# EAGLE schematic K019 with eeprom (EAGLE 6.3), part 1 of 2

## Sheet 1 of 4
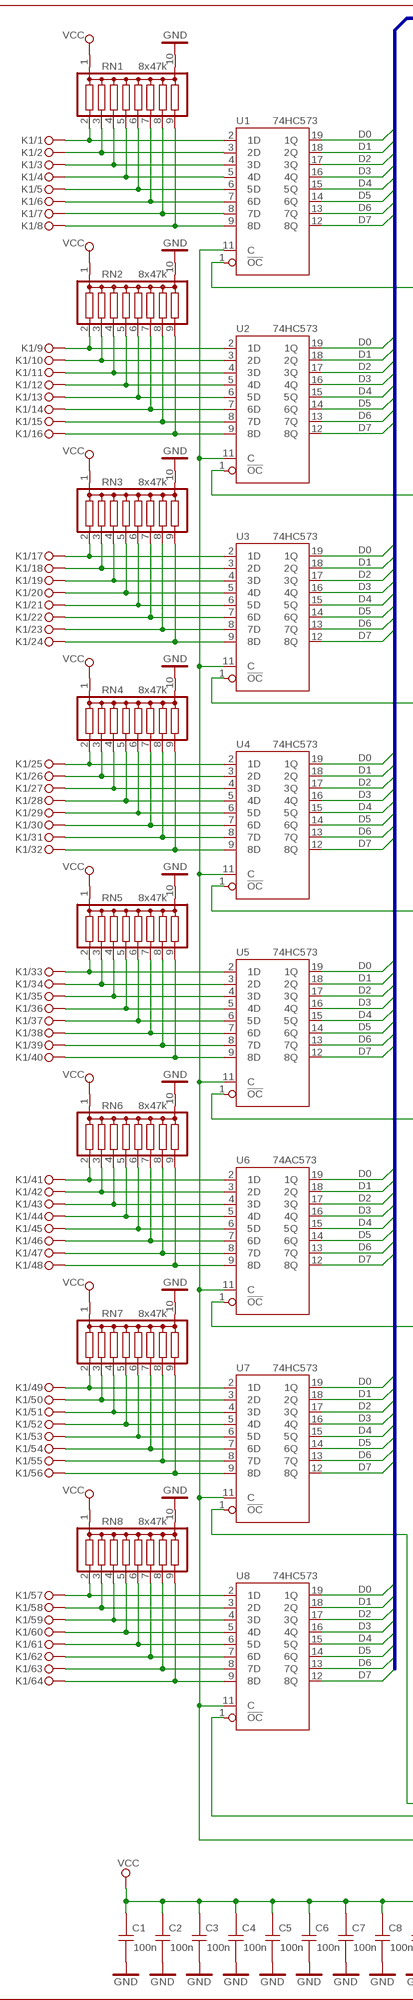
[diagram p0: schematic, sheet 1, part 1 of 2]
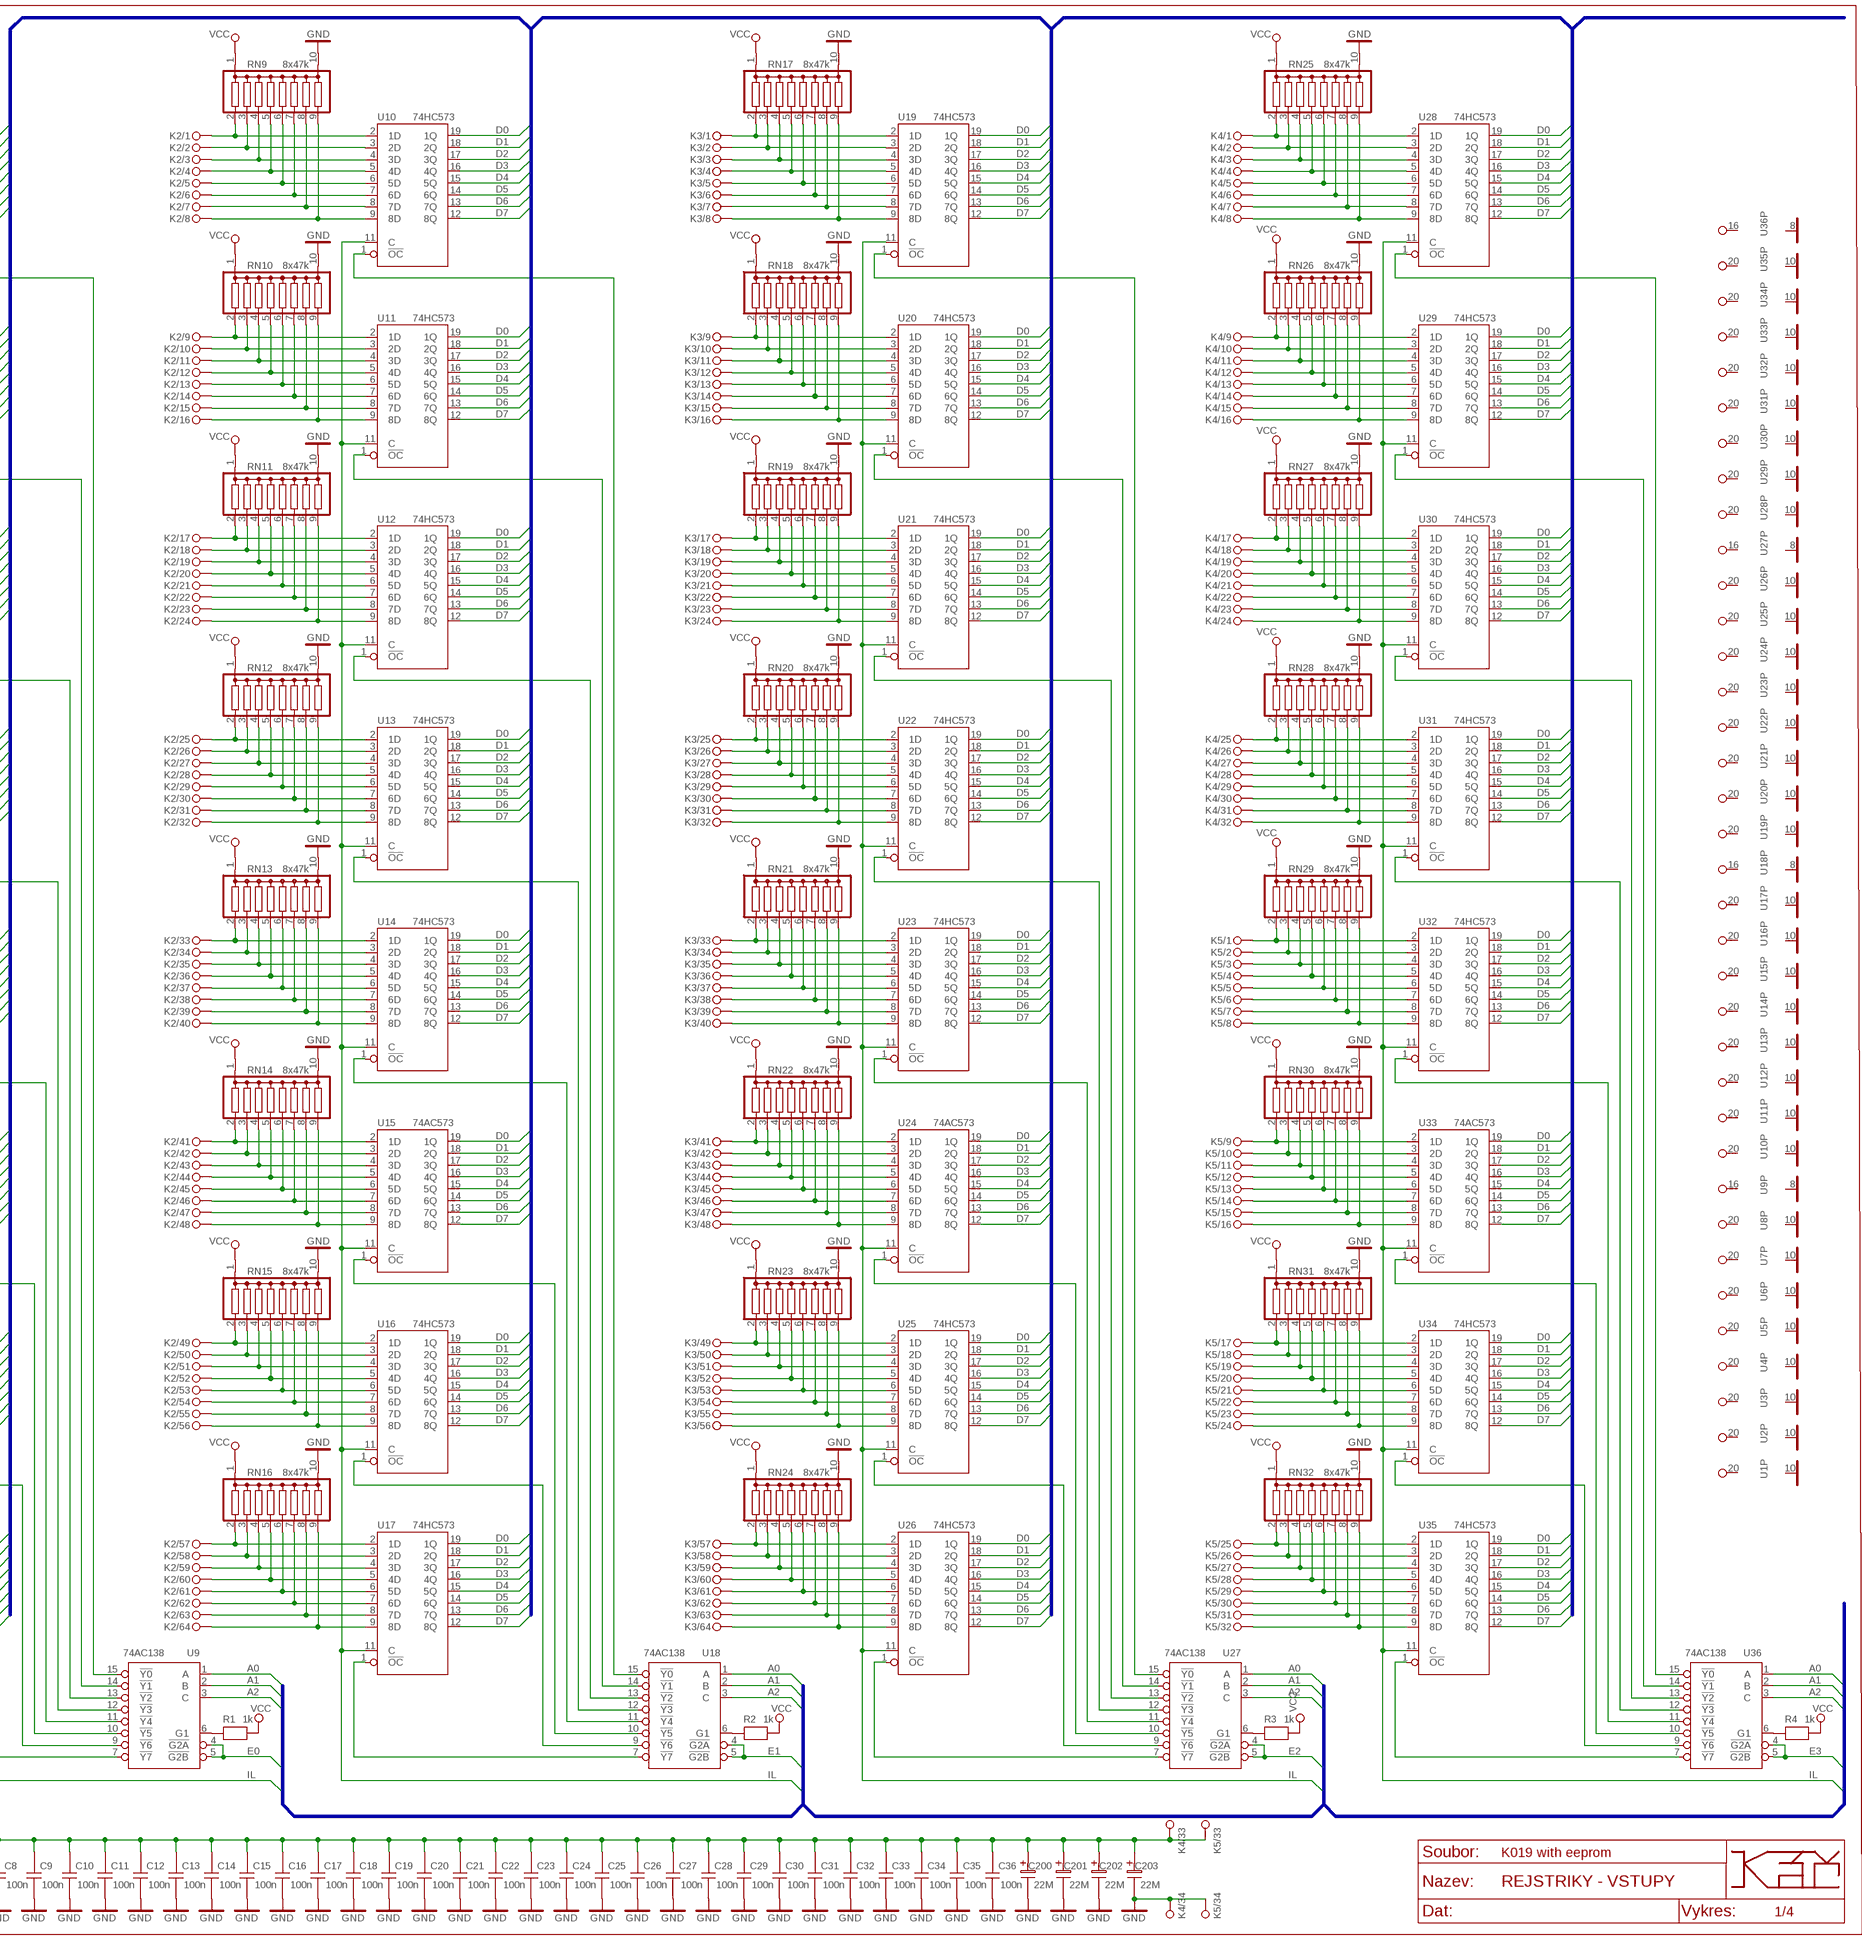
[diagram p1: schematic, sheet 1, part 2 of 2]

### Parts
C1  100n  C-5X8@2  [C-5-2X8]
C2  100n  C-5X8@2  [C-5-2X8]
C3  100n  C-5X8@2  [C-5-2X8]
C4  100n  C-5X8@2  [C-5-2X8]
C5  100n  C-5X8@2  [C-5-2X8]
C6  100n  C-5X8@2  [C-5-2X8]
C7  100n  C-5X8@2  [C-5-2X8]
C8  100n  C-5X8@2  [C-5-2X8]
C9  100n  C-5X8@2  [C-5-2X8]
C10  100n  C-5X8@2  [C-5-2X8]
C11  100n  C-5X8@2  [C-5-2X8]
C12  100n  C-5X8@2  [C-5-2X8]
C13  100n  C-5X8@2  [C-5-2X8]
C14  100n  C-5X8@2  [C-5-2X8]
C15  100n  C-5X8@2  [C-5-2X8]
C16  100n  C-5X8@2  [C-5-2X8]
C17  100n  C-5X8@2  [C-5-2X8]
C18  100n  C-5X8@2  [C-5-2X8]
C19  100n  C-5X8@2  [C-5-2X8]
C20  100n  C-5X8@2  [C-5-2X8]
C21  100n  C-5X8@2  [C-5-2X8]
C22  100n  C-5X8@2  [C-5-2X8]
C23  100n  C-5X8@2  [C-5-2X8]
C24  100n  C-5X8@2  [C-5-2X8]
C25  100n  C-5X8@2  [C-5-2X8]
C26  100n  C-5X8@2  [C-5-2X8]
C27  100n  C-5X8@2  [C-5-2X8]
C28  100n  C-5X8@2  [C-5-2X8]
C29  100n  C-5X8@2  [C-5-2X8]
C30  100n  C-5X8@2  [C-5-2X8]
C31  100n  C-5X8@2  [C-5-2X8]
C32  100n  C-5X8@2  [C-5-2X8]
C33  100n  C-5X8@2  [C-5-2X8]
C34  100n  C-5X8@2  [C-5-2X8]
C35  100n  C-5X8@2  [C-5-2X8]
C36  100n  C-5X8@2  [C-5-2X8]
C200  22M  EC-2/5  [EC-2/5]
C201  22M  EC-2/5  [EC-2/5]
C202  22M  EC-2/5  [EC-2/5]
C203  22M  EC-2/5  [EC-2/5]
K1  KON64  [KON64]
K2  KON64  [KON64]
K3  KON64  [KON64]
K4  KON34  [KON34]
K5  KON34  [KON34]
R1  1k  R-10-0,8@2  [R-7,5]
R2  1k  R-10-0,8@2  [R-7,5]
R3  1k  R-10-0,8@2  [R-7,5]
R4  1k  R-10-0,8@2  [R-7,5]
RN1  8x47k  R8+@3  [G08R+@3]
RN2  8x47k  R8+@3  [G08R+@3]
RN3  8x47k  R8+@3  [G08R+@3]
RN4  8x47k  R8+@4  [G08R+@4]
RN5  8x47k  R8+@4  [G08R+@4]
RN6  8x47k  R8+@4  [G08R+@4]
RN7  8x47k  R8+@4  [G08R+@4]
RN8  8x47k  R8+@4  [G08R+@4]
RN9  8x47k  R8+@3  [G08R+@3]
RN10  8x47k  R8+@3  [G08R+@3]
RN11  8x47k  R8+@3  [G08R+@3]
RN12  8x47k  R8+@3  [G08R+@3]
RN13  8x47k  R8+@3  [G08R+@3]
RN14  8x47k  R8+@3  [G08R+@3]
RN15  8x47k  R8+@3  [G08R+@3]
RN16  8x47k  R8+@3  [G08R+@3]
RN17  8x47k  R8+@3  [G08R+@3]
RN18  8x47k  R8+@3  [G08R+@3]
RN19  8x47k  R8+@3  [G08R+@3]
RN20  8x47k  R8+@3  [G08R+@3]
RN21  8x47k  R8+@3  [G08R+@3]
RN22  8x47k  R8+@3  [G08R+@3]
RN23  8x47k  R8+@3  [G08R+@3]
RN24  8x47k  R8+@3  [G08R+@3]
RN25  8x47k  R8+@3  [G08R+@3]
RN26  8x47k  R8+@3  [G08R+@3]
RN27  8x47k  R8+@3  [G08R+@3]
RN28  8x47k  R8+@3  [G08R+@3]
RN29  8x47k  R8+@3  [G08R+@3]
RN30  8x47k  R8+@3  [G08R+@3]
RN31  8x47k  R8+@3  [G08R+@3]
RN32  8x47k  R8+@3  [G08R+@3]
U1  74HC573  74AC573@2  [DIL20]
U2  74HC573  74AC573@2  [DIL20]
U3  74HC573  74AC573@2  [DIL20]
U4  74HC573  74AC573@2  [DIL20]
U5  74HC573  74AC573@2  [DIL20]
U6  74AC573  74AC573@2  [DIL20]
U7  74HC573  74AC573@2  [DIL20]
U8  74HC573  74AC573@2  [DIL20]
U9  74AC138  [DIL16]
U10  74HC573  74AC573@2  [DIL20]
U11  74HC573  74AC573@2  [DIL20]
U12  74HC573  74AC573@2  [DIL20]
U13  74HC573  74AC573@2  [DIL20]
U14  74HC573  74AC573@2  [DIL20]
U15  74AC573  74AC573@2  [DIL20]
U16  74HC573  74AC573@2  [DIL20]
U17  74HC573  74AC573@2  [DIL20]
U18  74AC138  [DIL16]
U19  74HC573  74AC573@2  [DIL20]
U20  74HC573  74AC573@2  [DIL20]
U21  74HC573  74AC573@2  [DIL20]
U22  74HC573  74AC573@2  [DIL20]
U23  74HC573  74AC573@2  [DIL20]
U24  74AC573  74AC573@2  [DIL20]
U25  74HC573  74AC573@2  [DIL20]
U26  74HC573  74AC573@2  [DIL20]
U27  74AC138  [DIL16]
U28  74HC573  74AC573@2  [DIL20]
U29  74HC573  74AC573@2  [DIL20]
U30  74HC573  74AC573@2  [DIL20]
U31  74HC573  74AC573@2  [DIL20]
U32  74HC573  74AC573@2  [DIL20]
U33  74AC573  74AC573@2  [DIL20]
U34  74HC573  74AC573@2  [DIL20]
U35  74HC573  74AC573@2  [DIL20]
U36  74AC138  [DIL16]

### Nets
A0: U9.1(A) U18.1(A) U27.1(A) U36.1(A) ; also sheet 2,3,4
A1: U9.2(B) U18.2(B) U27.2(B) U36.2(B) ; also sheet 2,3,4
A2: U9.3(C) U18.3(C) U27.3(C) U36.3(C) ; also sheet 2,3,4
D0: U1.19(1Q) U2.19(1Q) U3.19(1Q) U4.19(1Q) U5.19(1Q) U6.19(1Q) U7.19(1Q) U8.19(1Q) U10.19(1Q) U11.19(1Q) U12.19(1Q) U13.19(1Q) U14.19(1Q) U15.19(1Q) U16.19(1Q) U17.19(1Q) U19.19(1Q) U20.19(1Q) U21.19(1Q) U22.19(1Q) U23.19(1Q) U24.19(1Q) U25.19(1Q) U26.19(1Q) U28.19(1Q) U29.19(1Q) U30.19(1Q) U31.19(1Q) U32.19(1Q) U33.19(1Q) U34.19(1Q) U35.19(1Q) ; also sheet 2,3,4
D1: U1.18(2Q) U2.18(2Q) U3.18(2Q) U4.18(2Q) U5.18(2Q) U6.18(2Q) U7.18(2Q) U8.18(2Q) U10.18(2Q) U11.18(2Q) U12.18(2Q) U13.18(2Q) U14.18(2Q) U15.18(2Q) U16.18(2Q) U17.18(2Q) U19.18(2Q) U20.18(2Q) U21.18(2Q) U22.18(2Q) U23.18(2Q) U24.18(2Q) U25.18(2Q) U26.18(2Q) U28.18(2Q) U29.18(2Q) U30.18(2Q) U31.18(2Q) U32.18(2Q) U33.18(2Q) U34.18(2Q) U35.18(2Q) ; also sheet 2,3,4
D2: U1.17(3Q) U2.17(3Q) U3.17(3Q) U4.17(3Q) U5.17(3Q) U6.17(3Q) U7.17(3Q) U8.17(3Q) U10.17(3Q) U11.17(3Q) U12.17(3Q) U13.17(3Q) U14.17(3Q) U15.17(3Q) U16.17(3Q) U17.17(3Q) U19.17(3Q) U20.17(3Q) U21.17(3Q) U22.17(3Q) U23.17(3Q) U24.17(3Q) U25.17(3Q) U26.17(3Q) U28.17(3Q) U29.17(3Q) U30.17(3Q) U31.17(3Q) U32.17(3Q) U33.17(3Q) U34.17(3Q) U35.17(3Q) ; also sheet 2,3,4
D3: U1.16(4Q) U2.16(4Q) U3.16(4Q) U4.16(4Q) U5.16(4Q) U6.16(4Q) U7.16(4Q) U8.16(4Q) U10.16(4Q) U11.16(4Q) U12.16(4Q) U13.16(4Q) U14.16(4Q) U15.16(4Q) U16.16(4Q) U17.16(4Q) U19.16(4Q) U20.16(4Q) U21.16(4Q) U22.16(4Q) U23.16(4Q) U24.16(4Q) U25.16(4Q) U26.16(4Q) U28.16(4Q) U29.16(4Q) U30.16(4Q) U31.16(4Q) U32.16(4Q) U33.16(4Q) U34.16(4Q) U35.16(4Q) ; also sheet 2,3,4
D4: U1.15(5Q) U2.15(5Q) U3.15(5Q) U4.15(5Q) U5.15(5Q) U6.15(5Q) U7.15(5Q) U8.15(5Q) U10.15(5Q) U11.15(5Q) U12.15(5Q) U13.15(5Q) U14.15(5Q) U15.15(5Q) U16.15(5Q) U17.15(5Q) U19.15(5Q) U20.15(5Q) U21.15(5Q) U22.15(5Q) U23.15(5Q) U24.15(5Q) U25.15(5Q) U26.15(5Q) U28.15(5Q) U29.15(5Q) U30.15(5Q) U31.15(5Q) U32.15(5Q) U33.15(5Q) U34.15(5Q) U35.15(5Q) ; also sheet 2,3,4
D5: U1.14(6Q) U2.14(6Q) U3.14(6Q) U4.14(6Q) U5.14(6Q) U6.14(6Q) U7.14(6Q) U8.14(6Q) U10.14(6Q) U11.14(6Q) U12.14(6Q) U13.14(6Q) U14.14(6Q) U15.14(6Q) U16.14(6Q) U17.14(6Q) U19.14(6Q) U20.14(6Q) U21.14(6Q) U22.14(6Q) U23.14(6Q) U24.14(6Q) U25.14(6Q) U26.14(6Q) U28.14(6Q) U29.14(6Q) U30.14(6Q) U31.14(6Q) U32.14(6Q) U33.14(6Q) U34.14(6Q) U35.14(6Q) ; also sheet 2,3,4
D6: U1.13(7Q) U2.13(7Q) U3.13(7Q) U4.13(7Q) U5.13(7Q) U6.13(7Q) U7.13(7Q) U8.13(7Q) U10.13(7Q) U11.13(7Q) U12.13(7Q) U13.13(7Q) U14.13(7Q) U15.13(7Q) U16.13(7Q) U17.13(7Q) U19.13(7Q) U20.13(7Q) U21.13(7Q) U22.13(7Q) U23.13(7Q) U24.13(7Q) U25.13(7Q) U26.13(7Q) U28.13(7Q) U29.13(7Q) U30.13(7Q) U31.13(7Q) U32.13(7Q) U33.13(7Q) U34.13(7Q) U35.13(7Q) ; also sheet 2,3,4
D7: U1.12(8Q) U2.12(8Q) U3.12(8Q) U4.12(8Q) U5.12(8Q) U6.12(8Q) U7.12(8Q) U8.12(8Q) U10.12(8Q) U11.12(8Q) U12.12(8Q) U13.12(8Q) U14.12(8Q) U15.12(8Q) U16.12(8Q) U17.12(8Q) U19.12(8Q) U20.12(8Q) U21.12(8Q) U22.12(8Q) U23.12(8Q) U24.12(8Q) U25.12(8Q) U26.12(8Q) U28.12(8Q) U29.12(8Q) U30.12(8Q) U31.12(8Q) U32.12(8Q) U33.12(8Q) U34.12(8Q) U35.12(8Q) ; also sheet 2,3,4
E0: U9.4(!G2A) U9.5(!G2B) ; also sheet 4
E1: U18.4(!G2A) U18.5(!G2B) ; also sheet 4
E2: U27.4(!G2A) U27.5(!G2B) ; also sheet 4
E3: U36.4(!G2A) U36.5(!G2B) ; also sheet 4
GND: C1.1 C2.1 C3.1 C4.1 C5.1 C6.1 C7.1 C8.1 C9.1 C10.1 C11.1 C12.1 C13.1 C14.1 C15.1 C16.1 C17.1 C18.1 C19.1 C20.1 C21.1 C22.1 C23.1 C24.1 C25.1 C26.1 C27.1 C28.1 C29.1 C30.1 C31.1 C32.1 C33.1 C34.1 C35.1 C36.1 C200.1 C201.1 C202.1 C203.1 K4.34 K5.34 RN1.10 RN2.10 RN3.10 RN4.10 RN5.10 RN6.10 RN7.10 RN8.10 RN9.10 RN10.10 RN11.10 RN12.10 RN13.10 RN14.10 RN15.10 RN16.10 RN17.10 RN18.10 RN19.10 RN20.10 RN21.10 RN22.10 RN23.10 RN24.10 RN25.10 RN26.10 RN27.10 RN28.10 RN29.10 RN30.10 RN31.10 RN32.10 ; also sheet 2,3,4
IL: U1.11(C) U2.11(C) U3.11(C) U4.11(C) U5.11(C) U6.11(C) U7.11(C) U8.11(C) U10.11(C) U11.11(C) U12.11(C) U13.11(C) U14.11(C) U15.11(C) U16.11(C) U17.11(C) U19.11(C) U20.11(C) U21.11(C) U22.11(C) U23.11(C) U24.11(C) U25.11(C) U26.11(C) U28.11(C) U29.11(C) U30.11(C) U31.11(C) U32.11(C) U33.11(C) U34.11(C) U35.11(C) ; also sheet 4
N$1: U8.1(!OC) U9.7(!Y7)
N$2: U7.1(!OC) U9.9(!Y6)
N$3: U6.1(!OC) U9.10(!Y5)
N$4: U5.1(!OC) U9.11(!Y4)
N$5: U4.1(!OC) U9.12(!Y3)
N$6: U3.1(!OC) U9.13(!Y2)
N$7: U2.1(!OC) U9.14(!Y1)
N$8: U1.1(!OC) U9.15(!Y0)
N$9: U26.1(!OC) U27.7(!Y7)
N$10: K1.1 RN1.2 U1.2(1D)
N$11: K1.2 RN1.3 U1.3(2D)
N$12: K1.3 RN1.4 U1.4(3D)
N$13: K1.4 RN1.5 U1.5(4D)
N$14: K1.5 RN1.6 U1.6(5D)
N$15: K1.6 RN1.7 U1.7(6D)
N$16: K1.7 RN1.8 U1.8(7D)
N$17: K1.8 RN1.9 U1.9(8D)
N$18: K1.9 RN2.2 U2.2(1D)
N$19: K1.10 RN2.3 U2.3(2D)
N$20: K1.11 RN2.4 U2.4(3D)
N$21: K1.12 RN2.5 U2.5(4D)
N$22: K1.13 RN2.6 U2.6(5D)
N$23: K1.14 RN2.7 U2.7(6D)
N$24: K1.15 RN2.8 U2.8(7D)
N$25: K1.16 RN2.9 U2.9(8D)
N$26: K1.17 RN3.2 U3.2(1D)
N$27: K1.18 RN3.3 U3.3(2D)
N$28: K1.19 RN3.4 U3.4(3D)
N$29: K1.20 RN3.5 U3.5(4D)
N$30: K1.21 RN3.6 U3.6(5D)
N$31: K1.22 RN3.7 U3.7(6D)
N$32: K1.23 RN3.8 U3.8(7D)
N$33: K1.24 RN3.9 U3.9(8D)
N$34: K1.25 RN4.2 U4.2(1D)
N$35: K1.26 RN4.3 U4.3(2D)
N$36: K1.27 RN4.4 U4.4(3D)
N$37: K1.28 RN4.5 U4.5(4D)
N$38: K1.29 RN4.6 U4.6(5D)
N$39: K1.30 RN4.7 U4.7(6D)
N$40: K1.31 RN4.8 U4.8(7D)
N$41: K1.32 RN4.9 U4.9(8D)
N$42: K1.33 RN5.2 U5.2(1D)
N$43: K1.34 RN5.3 U5.3(2D)
N$44: K1.35 RN5.4 U5.4(3D)
N$45: K1.36 RN5.5 U5.5(4D)
N$46: K1.37 RN5.6 U5.6(5D)
N$47: K1.38 RN5.7 U5.7(6D)
N$48: K1.39 RN5.8 U5.8(7D)
N$49: K1.40 RN5.9 U5.9(8D)
N$50: K1.41 RN6.2 U6.2(1D)
N$51: K1.42 RN6.3 U6.3(2D)
N$52: K1.43 RN6.4 U6.4(3D)
N$53: K1.44 RN6.5 U6.5(4D)
N$54: K1.45 RN6.6 U6.6(5D)
N$55: K1.46 RN6.7 U6.7(6D)
N$56: K1.47 RN6.8 U6.8(7D)
N$57: K1.48 RN6.9 U6.9(8D)
N$58: K1.49 RN7.2 U7.2(1D)
N$59: K1.50 RN7.3 U7.3(2D)
N$60: K1.51 RN7.4 U7.4(3D)
N$61: K1.52 RN7.5 U7.5(4D)
N$62: K1.53 RN7.6 U7.6(5D)
N$63: K1.54 RN7.7 U7.7(6D)
N$64: K1.55 RN7.8 U7.8(7D)
N$65: K1.56 RN7.9 U7.9(8D)
N$66: K1.57 RN8.2 U8.2(1D)
N$67: K1.58 RN8.3 U8.3(2D)
N$68: K1.59 RN8.4 U8.4(3D)
N$69: K1.60 RN8.5 U8.5(4D)
N$70: K1.61 RN8.6 U8.6(5D)
N$71: K1.62 RN8.7 U8.7(6D)
N$72: K1.63 RN8.8 U8.8(7D)
N$73: K1.64 RN8.9 U8.9(8D)
N$74: U17.1(!OC) U18.7(!Y7)
N$75: U16.1(!OC) U18.9(!Y6)
N$76: U15.1(!OC) U18.10(!Y5)
N$77: U14.1(!OC) U18.11(!Y4)
N$78: U13.1(!OC) U18.12(!Y3)
N$79: U12.1(!OC) U18.13(!Y2)
N$80: U11.1(!OC) U18.14(!Y1)
N$81: U10.1(!OC) U18.15(!Y0)
N$82: U25.1(!OC) U27.9(!Y6)
N$83: K2.1 RN9.2 U10.2(1D)
N$84: K2.2 RN9.3 U10.3(2D)
N$85: K2.3 RN9.4 U10.4(3D)
N$86: K2.4 RN9.5 U10.5(4D)
N$87: K2.5 RN9.6 U10.6(5D)
N$88: K2.6 RN9.7 U10.7(6D)
N$89: K2.7 RN9.8 U10.8(7D)
N$90: K2.8 RN9.9 U10.9(8D)
N$91: K2.9 RN10.2 U11.2(1D)
N$92: K2.10 RN10.3 U11.3(2D)
N$93: K2.11 RN10.4 U11.4(3D)
N$94: K2.12 RN10.5 U11.5(4D)
N$95: K2.13 RN10.6 U11.6(5D)
N$96: K2.14 RN10.7 U11.7(6D)
N$97: K2.15 RN10.8 U11.8(7D)
N$98: K2.16 RN10.9 U11.9(8D)
N$99: K2.17 RN11.2 U12.2(1D)
N$100: K2.18 RN11.3 U12.3(2D)
N$101: K2.19 RN11.4 U12.4(3D)
N$102: K2.20 RN11.5 U12.5(4D)
N$103: K2.21 RN11.6 U12.6(5D)
N$104: K2.22 RN11.7 U12.7(6D)
N$105: K2.23 RN11.8 U12.8(7D)
N$106: K2.24 RN11.9 U12.9(8D)
N$107: K2.25 RN12.2 U13.2(1D)
N$108: K2.26 RN12.3 U13.3(2D)
N$109: K2.27 RN12.4 U13.4(3D)
N$110: K2.28 RN12.5 U13.5(4D)
N$111: K2.29 RN12.6 U13.6(5D)
N$112: K2.30 RN12.7 U13.7(6D)
N$113: K2.31 RN12.8 U13.8(7D)
N$114: K2.32 RN12.9 U13.9(8D)
N$115: K2.33 RN13.2 U14.2(1D)
N$116: K2.34 RN13.3 U14.3(2D)
N$117: K2.35 RN13.4 U14.4(3D)
N$118: K2.36 RN13.5 U14.5(4D)
N$119: K2.37 RN13.6 U14.6(5D)
N$120: K2.38 RN13.7 U14.7(6D)
N$121: K2.39 RN13.8 U14.8(7D)
N$122: K2.40 RN13.9 U14.9(8D)
N$123: K2.41 RN14.2 U15.2(1D)
N$124: K2.42 RN14.3 U15.3(2D)
N$125: K2.43 RN14.4 U15.4(3D)
N$126: K2.44 RN14.5 U15.5(4D)
N$127: K2.45 RN14.6 U15.6(5D)
N$128: K2.46 RN14.7 U15.7(6D)
N$129: K2.47 RN14.8 U15.8(7D)
N$130: K2.48 RN14.9 U15.9(8D)
N$131: K2.49 RN15.2 U16.2(1D)
N$132: K2.50 RN15.3 U16.3(2D)
N$133: K2.51 RN15.4 U16.4(3D)
N$134: K2.52 RN15.5 U16.5(4D)
N$135: K2.53 RN15.6 U16.6(5D)
N$136: K2.54 RN15.7 U16.7(6D)
N$137: K2.55 RN15.8 U16.8(7D)
N$138: K2.56 RN15.9 U16.9(8D)
N$139: K2.57 RN16.2 U17.2(1D)
N$140: K2.58 RN16.3 U17.3(2D)
N$141: K2.59 RN16.4 U17.4(3D)
N$142: K2.60 RN16.5 U17.5(4D)
N$143: K2.61 RN16.6 U17.6(5D)
N$144: K2.62 RN16.7 U17.7(6D)
N$145: K2.63 RN16.8 U17.8(7D)
N$146: K2.64 RN16.9 U17.9(8D)
N$147: U24.1(!OC) U27.10(!Y5)
N$148: U23.1(!OC) U27.11(!Y4)
N$149: U22.1(!OC) U27.12(!Y3)
N$150: U21.1(!OC) U27.13(!Y2)
N$151: U20.1(!OC) U27.14(!Y1)
N$152: U19.1(!OC) U27.15(!Y0)
N$153: K3.1 RN17.2 U19.2(1D)
N$154: K3.2 RN17.3 U19.3(2D)
N$155: K3.3 RN17.4 U19.4(3D)
N$156: K3.4 RN17.5 U19.5(4D)
N$157: K3.5 RN17.6 U19.6(5D)
N$158: K3.6 RN17.7 U19.7(6D)
N$159: K3.7 RN17.8 U19.8(7D)
N$160: K3.8 RN17.9 U19.9(8D)
N$161: K3.9 RN18.2 U20.2(1D)
N$162: K3.10 RN18.3 U20.3(2D)
N$163: K3.11 RN18.4 U20.4(3D)
N$164: K3.12 RN18.5 U20.5(4D)
N$165: K3.13 RN18.6 U20.6(5D)
N$166: K3.14 RN18.7 U20.7(6D)
N$167: K3.15 RN18.8 U20.8(7D)
N$168: K3.16 RN18.9 U20.9(8D)
N$169: K3.17 RN19.2 U21.2(1D)
N$170: K3.18 RN19.3 U21.3(2D)
N$171: K3.19 RN19.4 U21.4(3D)
N$172: K3.20 RN19.5 U21.5(4D)
N$173: K3.21 RN19.6 U21.6(5D)
N$174: K3.22 RN19.7 U21.7(6D)
N$175: K3.23 RN19.8 U21.8(7D)
N$176: K3.24 RN19.9 U21.9(8D)
N$177: K3.25 RN20.2 U22.2(1D)
N$178: K3.26 RN20.3 U22.3(2D)
N$179: K3.27 RN20.4 U22.4(3D)
N$180: K3.28 RN20.5 U22.5(4D)
N$181: K3.29 RN20.6 U22.6(5D)
N$182: K3.30 RN20.7 U22.7(6D)
N$183: K3.31 RN20.8 U22.8(7D)
N$184: K3.32 RN20.9 U22.9(8D)
N$185: K3.33 RN21.2 U23.2(1D)
N$186: K3.34 RN21.3 U23.3(2D)
N$187: K3.35 RN21.4 U23.4(3D)
N$188: K3.36 RN21.5 U23.5(4D)
N$189: K3.37 RN21.6 U23.6(5D)
N$190: K3.38 RN21.7 U23.7(6D)
N$191: K3.39 RN21.8 U23.8(7D)
N$192: K3.40 RN21.9 U23.9(8D)
N$193: K3.41 RN22.2 U24.2(1D)
N$194: K3.42 RN22.3 U24.3(2D)
N$195: K3.43 RN22.4 U24.4(3D)
N$196: K3.44 RN22.5 U24.5(4D)
N$197: K3.45 RN22.6 U24.6(5D)
N$198: K3.46 RN22.7 U24.7(6D)
N$199: K3.47 RN22.8 U24.8(7D)
N$200: K3.48 RN22.9 U24.9(8D)
N$201: K3.49 RN23.2 U25.2(1D)
N$202: K3.50 RN23.3 U25.3(2D)
N$203: K3.51 RN23.4 U25.4(3D)
N$204: K3.52 RN23.5 U25.5(4D)
N$205: K3.53 RN23.6 U25.6(5D)
N$206: K3.54 RN23.7 U25.7(6D)
N$207: K3.55 RN23.8 U25.8(7D)
N$208: K3.56 RN23.9 U25.9(8D)
N$209: K3.57 RN24.2 U26.2(1D)
N$210: K3.58 RN24.3 U26.3(2D)
N$211: K3.59 RN24.4 U26.4(3D)
N$212: K3.60 RN24.5 U26.5(4D)
N$213: K3.61 RN24.6 U26.6(5D)
N$214: K3.62 RN24.7 U26.7(6D)
N$215: K3.63 RN24.8 U26.8(7D)
N$216: K3.64 RN24.9 U26.9(8D)
N$217: U35.1(!OC) U36.7(!Y7)
N$218: U34.1(!OC) U36.9(!Y6)
N$219: U33.1(!OC) U36.10(!Y5)
N$220: U32.1(!OC) U36.11(!Y4)
N$221: U31.1(!OC) U36.12(!Y3)
N$222: U30.1(!OC) U36.13(!Y2)
N$223: U29.1(!OC) U36.14(!Y1)
N$224: U28.1(!OC) U36.15(!Y0)
N$225: K4.1 RN25.2 U28.2(1D)
N$226: K4.2 RN25.3 U28.3(2D)
N$227: K4.3 RN25.4 U28.4(3D)
N$228: K4.4 RN25.5 U28.5(4D)
N$229: K4.5 RN25.6 U28.6(5D)
N$230: K4.6 RN25.7 U28.7(6D)
N$231: K4.7 RN25.8 U28.8(7D)
N$232: K4.8 RN25.9 U28.9(8D)
N$233: K4.9 RN26.2 U29.2(1D)
N$234: K4.10 RN26.3 U29.3(2D)
N$235: K4.11 RN26.4 U29.4(3D)
N$236: K4.12 RN26.5 U29.5(4D)
N$237: K4.13 RN26.6 U29.6(5D)
N$238: K4.14 RN26.7 U29.7(6D)
N$239: K4.15 RN26.8 U29.8(7D)
N$240: K4.16 RN26.9 U29.9(8D)
N$241: K4.17 RN27.2 U30.2(1D)
N$242: K4.18 RN27.3 U30.3(2D)
N$243: K4.19 RN27.4 U30.4(3D)
N$244: K4.20 RN27.5 U30.5(4D)
N$245: K4.21 RN27.6 U30.6(5D)
N$246: K4.22 RN27.7 U30.7(6D)
N$247: K4.23 RN27.8 U30.8(7D)
N$248: K4.24 RN27.9 U30.9(8D)
N$249: K4.25 RN28.2 U31.2(1D)
N$250: K4.26 RN28.3 U31.3(2D)
N$251: K4.27 RN28.4 U31.4(3D)
N$252: K4.28 RN28.5 U31.5(4D)
N$253: K4.29 RN28.6 U31.6(5D)
N$254: K4.30 RN28.7 U31.7(6D)
N$255: K4.31 RN28.8 U31.8(7D)
N$256: K4.32 RN28.9 U31.9(8D)
N$257: K5.1 RN29.2 U32.2(1D)
N$258: K5.2 RN29.3 U32.3(2D)
N$259: K5.3 RN29.4 U32.4(3D)
N$260: K5.4 RN29.5 U32.5(4D)
N$261: K5.5 RN29.6 U32.6(5D)
N$262: K5.6 RN29.7 U32.7(6D)
N$263: K5.7 RN29.8 U32.8(7D)
N$264: K5.8 RN29.9 U32.9(8D)
N$265: K5.9 RN30.2 U33.2(1D)
N$266: K5.10 RN30.3 U33.3(2D)
N$267: K5.11 RN30.4 U33.4(3D)
N$268: K5.12 RN30.5 U33.5(4D)
N$269: K5.13 RN30.6 U33.6(5D)
N$270: K5.14 RN30.7 U33.7(6D)
N$271: K5.15 RN30.8 U33.8(7D)
N$272: K5.16 RN30.9 U33.9(8D)
N$273: K5.17 RN31.2 U34.2(1D)
N$274: K5.18 RN31.3 U34.3(2D)
N$275: K5.19 RN31.4 U34.4(3D)
N$276: K5.20 RN31.5 U34.5(4D)
N$277: K5.21 RN31.6 U34.6(5D)
N$278: K5.22 RN31.7 U34.7(6D)
N$279: K5.23 RN31.8 U34.8(7D)
N$280: K5.24 RN31.9 U34.9(8D)
N$281: K5.25 RN32.2 U35.2(1D)
N$282: K5.26 RN32.3 U35.3(2D)
N$283: K5.27 RN32.4 U35.4(3D)
N$284: K5.28 RN32.5 U35.5(4D)
N$285: K5.29 RN32.6 U35.6(5D)
N$286: K5.30 RN32.7 U35.7(6D)
N$287: K5.31 RN32.8 U35.8(7D)
N$288: K5.32 RN32.9 U35.9(8D)
N$416: R1.1 U9.6(G1)
N$417: R2.1 U18.6(G1)
N$418: R3.1 U27.6(G1)
N$419: R4.1 U36.6(G1)
VCC: C1.2 C2.2 C3.2 C4.2 C5.2 C6.2 C7.2 C8.2 C9.2 C10.2 C11.2 C12.2 C13.2 C14.2 C15.2 C16.2 C17.2 C18.2 C19.2 C20.2 C21.2 C22.2 C23.2 C24.2 C25.2 C26.2 C27.2 C28.2 C29.2 C30.2 C31.2 C32.2 C33.2 C34.2 C35.2 C36.2 C200.2 C201.2 C202.2 C203.2 K4.33 K5.33 R1.2 R2.2 R3.2 R4.2 RN1.1 RN2.1 RN3.1 RN4.1 RN5.1 RN6.1 RN7.1 RN8.1 RN9.1 RN10.1 RN11.1 RN12.1 RN13.1 RN14.1 RN15.1 RN16.1 RN17.1 RN18.1 RN19.1 RN20.1 RN21.1 RN22.1 RN23.1 RN24.1 RN25.1 RN26.1 RN27.1 RN28.1 RN29.1 RN30.1 RN31.1 RN32.1 ; also sheet 2,3,4

### Buses
D[0..7]
A[0..5],E[0..15],IL,OL

### Notes on the sheet
- REJSTRIKY - VSTUPY

## Sheet 2 of 4
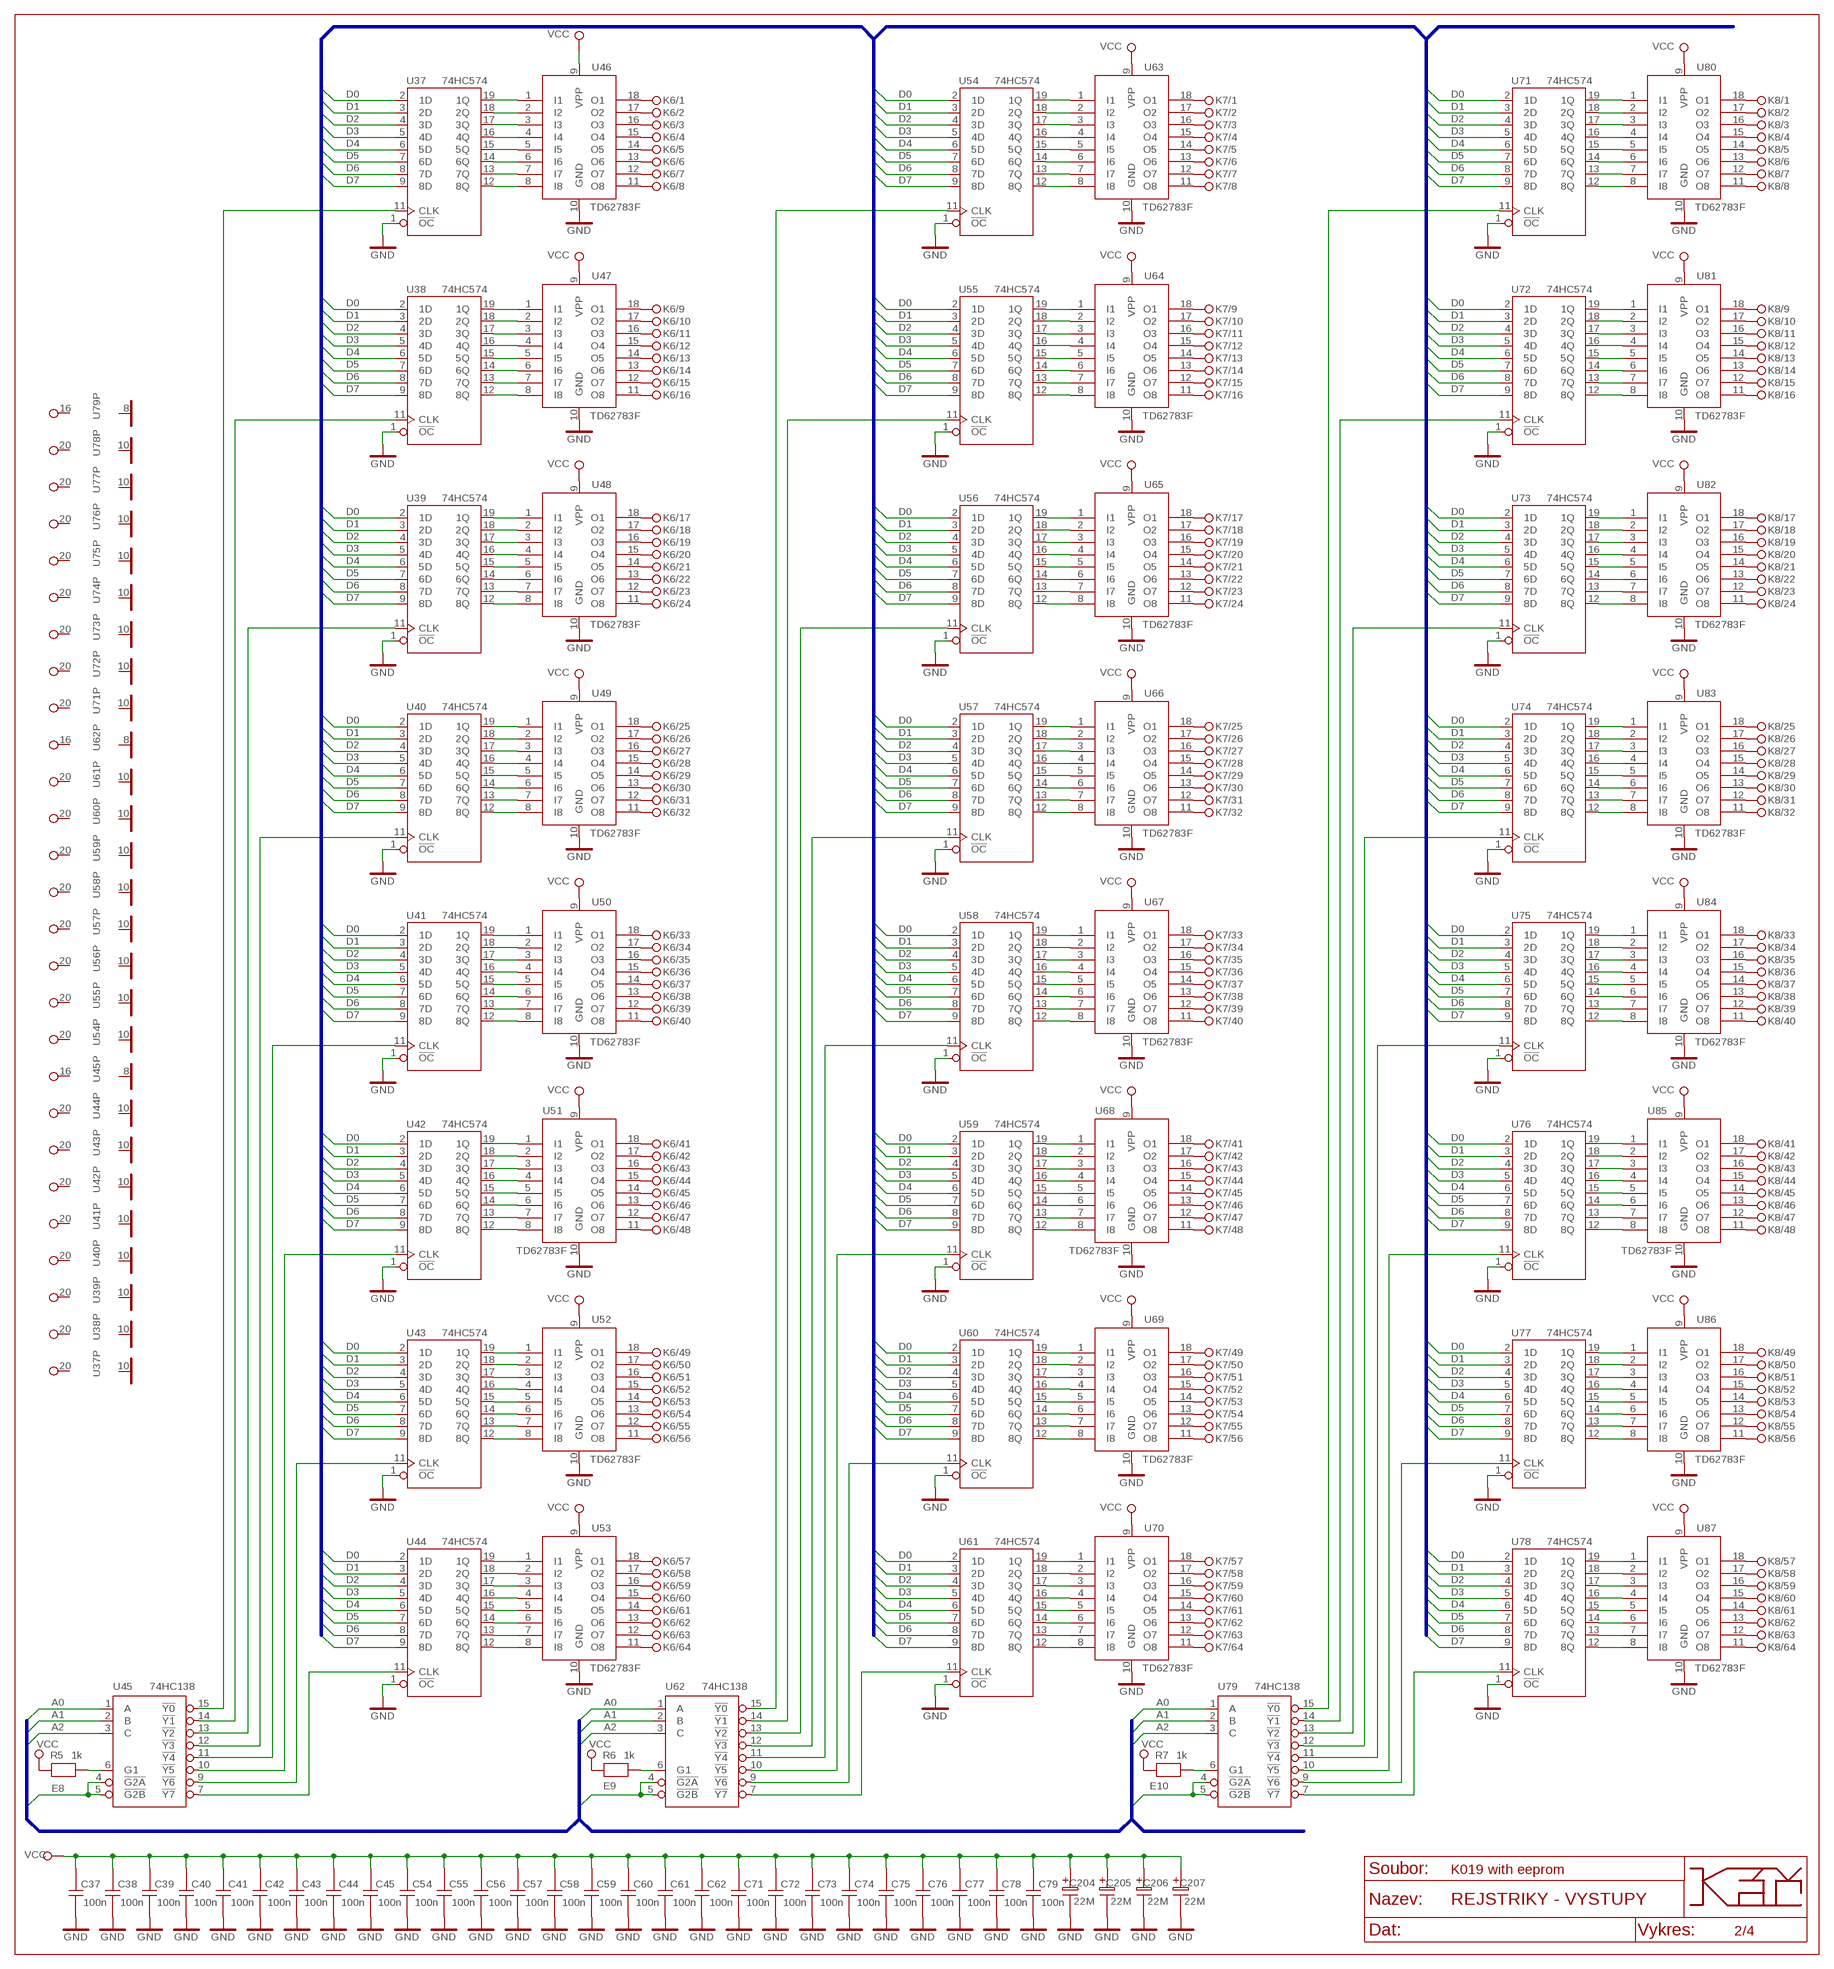
[diagram p2: schematic, sheet 2]

### Parts
C37  100n  C-5X8@2  [C-5-2X8]
C38  100n  C-5X8@2  [C-5-2X8]
C39  100n  C-5X8@2  [C-5-2X8]
C40  100n  C-5X8@2  [C-5-2X8]
C41  100n  C-5X8@2  [C-5-2X8]
C42  100n  C-5X8@2  [C-5-2X8]
C43  100n  C-5X8@2  [C-5-2X8]
C44  100n  C-5X8@2  [C-5-2X8]
C45  100n  C-5X8@2  [C-5-2X8]
C54  100n  C-5X8@2  [C-5-2X8]
C55  100n  C-5X8@2  [C-5-2X8]
C56  100n  C-5X8@2  [C-5-2X8]
C57  100n  C-5X8@2  [C-5-2X8]
C58  100n  C-5X8@2  [C-5-2X8]
C59  100n  C-5X8@2  [C-5-2X8]
C60  100n  C-5X8@2  [C-5-2X8]
C61  100n  C-5X8@2  [C-5-2X8]
C62  100n  C-5X8@2  [C-5-2X8]
C71  100n  C-5X8@2  [C-5-2X8]
C72  100n  C-5X8@2  [C-5-2X8]
C73  100n  C-5X8@2  [C-5-2X8]
C74  100n  C-5X8@2  [C-5-2X8]
C75  100n  C-5X8@2  [C-5-2X8]
C76  100n  C-5X8@2  [C-5-2X8]
C77  100n  C-5X8@2  [C-5-2X8]
C78  100n  C-5X8@2  [C-5-2X8]
C79  100n  C-5X8@2  [C-5-2X8]
C204  22M  EC-2/5  [EC-2/5]
C205  22M  EC-2/5  [EC-2/5]
C206  22M  EC-2/5  [EC-2/5]
C207  22M  EC-2/5  [EC-2/5]
K6  KON64  [KON64]
K7  KON64  [KON64]
K8  KON64  [KON64]
R5  1k  R-10-0,8@2  [R-7,5]
R6  1k  R-10-0,8@2  [R-7,5]
R7  1k  R-10-0,8@2  [R-7,5]
U37  74HC574  74AC574@2  [DIL20]
U38  74HC574  74AC574@2  [DIL20]
U39  74HC574  74AC574@2  [DIL20]
U40  74HC574  74AC574@2  [DIL20]
U41  74HC574  74AC574@2  [DIL20]
U42  74HC574  74AC574@2  [DIL20]
U43  74HC574  74AC574@2  [DIL20]
U44  74HC574  74AC574@2  [DIL20]
U45  74HC138  74AC138  [DIL16]
U46  TD62783F  TD62783F@2  [DIL18]
U47  TD62783F  TD62783F@2  [DIL18]
U48  TD62783F  TD62783F@2  [DIL18]
U49  TD62783F  TD62783F@2  [DIL18]
U50  TD62783F  TD62783F@2  [DIL18]
U51  TD62783F  TD62783F@2  [DIL18]
U52  TD62783F  TD62783F@2  [DIL18]
U53  TD62783F  TD62783F@2  [DIL18]
U54  74HC574  74AC574@2  [DIL20]
U55  74HC574  74AC574@2  [DIL20]
U56  74HC574  74AC574@2  [DIL20]
U57  74HC574  74AC574@2  [DIL20]
U58  74HC574  74AC574@2  [DIL20]
U59  74HC574  74AC574@2  [DIL20]
U60  74HC574  74AC574@2  [DIL20]
U61  74HC574  74AC574@2  [DIL20]
U62  74HC138  74AC138  [DIL16]
U63  TD62783F  TD62783F@2  [DIL18]
U64  TD62783F  TD62783F@2  [DIL18]
U65  TD62783F  TD62783F@2  [DIL18]
U66  TD62783F  TD62783F@2  [DIL18]
U67  TD62783F  TD62783F@2  [DIL18]
U68  TD62783F  TD62783F@2  [DIL18]
U69  TD62783F  TD62783F@2  [DIL18]
U70  TD62783F  TD62783F@2  [DIL18]
U71  74HC574  74AC574@2  [DIL20]
U72  74HC574  74AC574@2  [DIL20]
U73  74HC574  74AC574@2  [DIL20]
U74  74HC574  74AC574@2  [DIL20]
U75  74HC574  74AC574@2  [DIL20]
U76  74HC574  74AC574@2  [DIL20]
U77  74HC574  74AC574@2  [DIL20]
U78  74HC574  74AC574@2  [DIL20]
U79  74HC138  74AC138  [DIL16]
U80  TD62783F  TD62783F@2  [DIL18]
U81  TD62783F  TD62783F@2  [DIL18]
U82  TD62783F  TD62783F@2  [DIL18]
U83  TD62783F  TD62783F@2  [DIL18]
U84  TD62783F  TD62783F@2  [DIL18]
U85  TD62783F  TD62783F@2  [DIL18]
U86  TD62783F  TD62783F@2  [DIL18]
U87  TD62783F  TD62783F@2  [DIL18]

### Nets
A0: U45.1(A) U62.1(A) U79.1(A) ; also sheet 1,3,4
A1: U45.2(B) U62.2(B) U79.2(B) ; also sheet 1,3,4
A2: U45.3(C) U62.3(C) U79.3(C) ; also sheet 1,3,4
D0: U37.2(1D) U38.2(1D) U39.2(1D) U40.2(1D) U41.2(1D) U42.2(1D) U43.2(1D) U44.2(1D) U54.2(1D) U55.2(1D) U56.2(1D) U57.2(1D) U58.2(1D) U59.2(1D) U60.2(1D) U61.2(1D) U71.2(1D) U72.2(1D) U73.2(1D) U74.2(1D) U75.2(1D) U76.2(1D) U77.2(1D) U78.2(1D) ; also sheet 1,3,4
D1: U37.3(2D) U38.3(2D) U39.3(2D) U40.3(2D) U41.3(2D) U42.3(2D) U43.3(2D) U44.3(2D) U54.3(2D) U55.3(2D) U56.3(2D) U57.3(2D) U58.3(2D) U59.3(2D) U60.3(2D) U61.3(2D) U71.3(2D) U72.3(2D) U73.3(2D) U74.3(2D) U75.3(2D) U76.3(2D) U77.3(2D) U78.3(2D) ; also sheet 1,3,4
D2: U37.4(3D) U38.4(3D) U39.4(3D) U40.4(3D) U41.4(3D) U42.4(3D) U43.4(3D) U44.4(3D) U54.4(3D) U55.4(3D) U56.4(3D) U57.4(3D) U58.4(3D) U59.4(3D) U60.4(3D) U61.4(3D) U71.4(3D) U72.4(3D) U73.4(3D) U74.4(3D) U75.4(3D) U76.4(3D) U77.4(3D) U78.4(3D) ; also sheet 1,3,4
D3: U37.5(4D) U38.5(4D) U39.5(4D) U40.5(4D) U41.5(4D) U42.5(4D) U43.5(4D) U44.5(4D) U54.5(4D) U55.5(4D) U56.5(4D) U57.5(4D) U58.5(4D) U59.5(4D) U60.5(4D) U61.5(4D) U71.5(4D) U72.5(4D) U73.5(4D) U74.5(4D) U75.5(4D) U76.5(4D) U77.5(4D) U78.5(4D) ; also sheet 1,3,4
D4: U37.6(5D) U38.6(5D) U39.6(5D) U40.6(5D) U41.6(5D) U42.6(5D) U43.6(5D) U44.6(5D) U54.6(5D) U55.6(5D) U56.6(5D) U57.6(5D) U58.6(5D) U59.6(5D) U60.6(5D) U61.6(5D) U71.6(5D) U72.6(5D) U73.6(5D) U74.6(5D) U75.6(5D) U76.6(5D) U77.6(5D) U78.6(5D) ; also sheet 1,3,4
D5: U37.7(6D) U38.7(6D) U39.7(6D) U40.7(6D) U41.7(6D) U42.7(6D) U43.7(6D) U44.7(6D) U54.7(6D) U55.7(6D) U56.7(6D) U57.7(6D) U58.7(6D) U59.7(6D) U60.7(6D) U61.7(6D) U71.7(6D) U72.7(6D) U73.7(6D) U74.7(6D) U75.7(6D) U76.7(6D) U77.7(6D) U78.7(6D) ; also sheet 1,3,4
D6: U37.8(7D) U38.8(7D) U39.8(7D) U40.8(7D) U41.8(7D) U42.8(7D) U43.8(7D) U44.8(7D) U54.8(7D) U55.8(7D) U56.8(7D) U57.8(7D) U58.8(7D) U59.8(7D) U60.8(7D) U61.8(7D) U71.8(7D) U72.8(7D) U73.8(7D) U74.8(7D) U75.8(7D) U76.8(7D) U77.8(7D) U78.8(7D) ; also sheet 1,3,4
D7: U37.9(8D) U38.9(8D) U39.9(8D) U40.9(8D) U41.9(8D) U42.9(8D) U43.9(8D) U44.9(8D) U54.9(8D) U55.9(8D) U56.9(8D) U57.9(8D) U58.9(8D) U59.9(8D) U60.9(8D) U61.9(8D) U71.9(8D) U72.9(8D) U73.9(8D) U74.9(8D) U75.9(8D) U76.9(8D) U77.9(8D) U78.9(8D) ; also sheet 1,3,4
E8: U45.4(!G2A) U45.5(!G2B) ; also sheet 4
E9: U62.4(!G2A) U62.5(!G2B) ; also sheet 4
E10: U79.4(!G2A) U79.5(!G2B) ; also sheet 4
GND: C37.1 C38.1 C39.1 C40.1 C41.1 C42.1 C43.1 C44.1 C45.1 C54.1 C55.1 C56.1 C57.1 C58.1 C59.1 C60.1 C61.1 C62.1 C71.1 C72.1 C73.1 C74.1 C75.1 C76.1 C77.1 C78.1 C79.1 C204.1 C205.1 C206.1 C207.1 U37.1(!OC) U38.1(!OC) U39.1(!OC) U40.1(!OC) U41.1(!OC) U42.1(!OC) U43.1(!OC) U44.1(!OC) U46.10(GND) U47.10(GND) U48.10(GND) U49.10(GND) U50.10(GND) U51.10(GND) U52.10(GND) U53.10(GND) U54.1(!OC) U55.1(!OC) U56.1(!OC) U57.1(!OC) U58.1(!OC) U59.1(!OC) U60.1(!OC) U61.1(!OC) U63.10(GND) U64.10(GND) U65.10(GND) U66.10(GND) U67.10(GND) U68.10(GND) U69.10(GND) U70.10(GND) U71.1(!OC) U72.1(!OC) U73.1(!OC) U74.1(!OC) U75.1(!OC) U76.1(!OC) U77.1(!OC) U78.1(!OC) U80.10(GND) U81.10(GND) U82.10(GND) U83.10(GND) U84.10(GND) U85.10(GND) U86.10(GND) U87.10(GND) ; also sheet 1,3,4
N$289: K6.1 U46.18(O1)
N$290: K6.2 U46.17(O2)
N$291: K6.3 U46.16(O3)
N$292: K6.4 U46.15(O4)
N$293: K6.5 U46.14(O5)
N$294: K6.6 U46.13(O6)
N$295: K6.7 U46.12(O7)
N$296: K6.8 U46.11(O8)
N$297: K6.9 U47.18(O1)
N$298: K6.10 U47.17(O2)
N$299: K6.11 U47.16(O3)
N$300: K6.12 U47.15(O4)
N$301: K6.13 U47.14(O5)
N$302: K6.14 U47.13(O6)
N$303: K6.15 U47.12(O7)
N$304: K6.16 U47.11(O8)
N$305: K6.17 U48.18(O1)
N$306: K6.18 U48.17(O2)
N$307: K6.19 U48.16(O3)
N$308: K6.20 U48.15(O4)
N$309: K6.21 U48.14(O5)
N$310: K6.22 U48.13(O6)
N$311: K6.23 U48.12(O7)
N$312: K6.24 U48.11(O8)
N$313: K6.25 U49.18(O1)
N$314: K6.26 U49.17(O2)
N$315: K6.27 U49.16(O3)
N$316: K6.28 U49.15(O4)
N$317: K6.29 U49.14(O5)
N$318: K6.30 U49.13(O6)
N$319: K6.31 U49.12(O7)
N$320: K6.32 U49.11(O8)
N$321: K6.33 U50.18(O1)
N$322: K6.34 U50.17(O2)
N$323: K6.35 U50.16(O3)
N$324: K6.36 U50.15(O4)
N$325: K6.37 U50.14(O5)
N$326: K6.38 U50.13(O6)
N$327: K6.39 U50.12(O7)
N$328: K6.40 U50.11(O8)
N$329: K6.41 U51.18(O1)
N$330: K6.42 U51.17(O2)
N$331: K6.43 U51.16(O3)
N$332: K6.44 U51.15(O4)
N$333: K6.45 U51.14(O5)
N$334: K6.46 U51.13(O6)
N$335: K6.47 U51.12(O7)
N$336: K6.48 U51.11(O8)
N$337: K6.49 U52.18(O1)
N$338: K6.50 U52.17(O2)
N$339: K6.51 U52.16(O3)
N$340: K6.52 U52.15(O4)
N$341: K6.53 U52.14(O5)
N$342: K6.54 U52.13(O6)
N$343: K6.55 U52.12(O7)
N$344: K6.56 U52.11(O8)
N$345: K6.57 U53.18(O1)
N$346: K6.58 U53.17(O2)
N$347: K6.59 U53.16(O3)
N$348: K6.60 U53.15(O4)
N$349: K6.61 U53.14(O5)
N$350: K6.62 U53.13(O6)
N$351: K6.63 U53.12(O7)
N$352: K6.64 U53.11(O8)
N$353: U44.12(8Q) U53.8(I8)
N$354: U44.13(7Q) U53.7(I7)
N$355: U44.14(6Q) U53.6(I6)
N$356: U44.15(5Q) U53.5(I5)
N$357: U44.16(4Q) U53.4(I4)
N$358: U44.17(3Q) U53.3(I3)
N$359: U44.18(2Q) U53.2(I2)
N$360: U44.19(1Q) U53.1(I1)
N$361: U43.12(8Q) U52.8(I8)
N$362: U43.13(7Q) U52.7(I7)
N$363: U43.14(6Q) U52.6(I6)
N$364: U43.15(5Q) U52.5(I5)
N$365: U43.16(4Q) U52.4(I4)
N$366: U43.17(3Q) U52.3(I3)
N$367: U43.18(2Q) U52.2(I2)
N$368: U43.19(1Q) U52.1(I1)
N$369: U41.19(1Q) U50.1(I1)
N$370: U41.18(2Q) U50.2(I2)
N$371: U41.17(3Q) U50.3(I3)
N$372: U41.16(4Q) U50.4(I4)
N$373: U41.15(5Q) U50.5(I5)
N$374: U41.14(6Q) U50.6(I6)
N$375: U41.13(7Q) U50.7(I7)
N$376: U41.12(8Q) U50.8(I8)
N$377: U42.12(8Q) U51.8(I8)
N$378: U42.13(7Q) U51.7(I7)
N$379: U42.14(6Q) U51.6(I6)
N$380: U42.15(5Q) U51.5(I5)
N$381: U42.16(4Q) U51.4(I4)
N$382: U42.17(3Q) U51.3(I3)
N$383: U42.18(2Q) U51.2(I2)
N$384: U40.12(8Q) U49.8(I8)
N$385: U40.13(7Q) U49.7(I7)
N$386: U40.14(6Q) U49.6(I6)
N$387: U40.15(5Q) U49.5(I5)
N$388: U40.16(4Q) U49.4(I4)
N$389: U40.17(3Q) U49.3(I3)
N$390: U40.18(2Q) U49.2(I2)
N$391: U40.19(1Q) U49.1(I1)
N$392: U38.19(1Q) U47.1(I1)
N$393: U38.18(2Q) U47.2(I2)
N$394: U38.17(3Q) U47.3(I3)
N$395: U38.16(4Q) U47.4(I4)
N$396: U38.15(5Q) U47.5(I5)
N$397: U38.14(6Q) U47.6(I6)
N$398: U38.13(7Q) U47.7(I7)
N$399: U38.12(8Q) U47.8(I8)
N$400: U39.19(1Q) U48.1(I1)
N$401: U39.18(2Q) U48.2(I2)
N$402: U39.17(3Q) U48.3(I3)
N$403: U39.16(4Q) U48.4(I4)
N$404: U39.15(5Q) U48.5(I5)
N$405: U39.14(6Q) U48.6(I6)
N$406: U39.13(7Q) U48.7(I7)
N$407: U39.12(8Q) U48.8(I8)
N$408: U37.12(8Q) U46.8(I8)
N$409: U37.13(7Q) U46.7(I7)
N$410: U37.14(6Q) U46.6(I6)
N$411: U37.15(5Q) U46.5(I5)
N$412: U37.16(4Q) U46.4(I4)
N$413: U37.17(3Q) U46.3(I3)
N$414: U37.18(2Q) U46.2(I2)
N$415: U37.19(1Q) U46.1(I1)
N$420: U42.19(1Q) U51.1(I1)
N$421: U44.11(CLK) U45.7(!Y7)
N$422: U43.11(CLK) U45.9(!Y6)
N$423: U42.11(CLK) U45.10(!Y5)
N$424: U41.11(CLK) U45.11(!Y4)
N$425: U40.11(CLK) U45.12(!Y3)
N$426: U39.11(CLK) U45.13(!Y2)
N$427: U38.11(CLK) U45.14(!Y1)
N$428: U37.11(CLK) U45.15(!Y0)
N$429: R5.2 U45.6(G1)
N$430: K7.1 U63.18(O1)
N$431: K7.2 U63.17(O2)
N$432: K7.3 U63.16(O3)
N$433: K7.4 U63.15(O4)
N$434: K7.5 U63.14(O5)
N$435: K7.6 U63.13(O6)
N$436: K7.7 U63.12(O7)
N$437: K7.8 U63.11(O8)
N$438: K7.9 U64.18(O1)
N$439: K7.10 U64.17(O2)
N$440: K7.11 U64.16(O3)
N$441: K7.12 U64.15(O4)
N$442: K7.13 U64.14(O5)
N$443: K7.14 U64.13(O6)
N$444: K7.15 U64.12(O7)
N$445: K7.16 U64.11(O8)
N$446: K7.25 U66.18(O1)
N$447: K7.26 U66.17(O2)
N$448: K7.27 U66.16(O3)
N$449: K7.28 U66.15(O4)
N$450: K7.29 U66.14(O5)
N$451: K7.30 U66.13(O6)
N$452: K7.31 U66.12(O7)
N$453: K7.32 U66.11(O8)
N$454: K7.33 U67.18(O1)
N$455: K7.34 U67.17(O2)
N$456: K7.35 U67.16(O3)
N$457: K7.36 U67.15(O4)
N$458: K7.37 U67.14(O5)
N$459: K7.38 U67.13(O6)
N$460: K7.39 U67.12(O7)
N$461: K7.40 U67.11(O8)
N$462: K7.41 U68.18(O1)
N$463: K7.42 U68.17(O2)
N$464: K7.43 U68.16(O3)
N$465: K7.44 U68.15(O4)
N$466: K7.45 U68.14(O5)
N$467: K7.46 U68.13(O6)
N$468: K7.47 U68.12(O7)
N$469: K7.48 U68.11(O8)
N$470: K7.49 U69.18(O1)
N$471: K7.50 U69.17(O2)
N$472: K7.51 U69.16(O3)
N$473: K7.52 U69.15(O4)
N$474: K7.53 U69.14(O5)
N$475: K7.54 U69.13(O6)
N$476: K7.55 U69.12(O7)
N$477: K7.56 U69.11(O8)
N$478: K7.57 U70.18(O1)
N$479: K7.58 U70.17(O2)
N$480: K7.59 U70.16(O3)
N$481: K7.60 U70.15(O4)
N$482: K7.61 U70.14(O5)
N$483: K7.62 U70.13(O6)
N$484: K7.63 U70.12(O7)
N$485: K7.64 U70.11(O8)
N$486: U61.12(8Q) U70.8(I8)
N$487: U61.13(7Q) U70.7(I7)
N$488: U61.14(6Q) U70.6(I6)
N$489: U61.15(5Q) U70.5(I5)
N$490: U61.16(4Q) U70.4(I4)
N$491: U61.17(3Q) U70.3(I3)
N$492: U61.18(2Q) U70.2(I2)
N$493: U61.19(1Q) U70.1(I1)
N$494: U60.12(8Q) U69.8(I8)
N$495: U60.13(7Q) U69.7(I7)
N$496: U60.14(6Q) U69.6(I6)
N$497: U60.15(5Q) U69.5(I5)
N$498: U60.16(4Q) U69.4(I4)
N$499: U60.17(3Q) U69.3(I3)
N$500: U60.18(2Q) U69.2(I2)
N$501: U60.19(1Q) U69.1(I1)
N$502: U58.19(1Q) U67.1(I1)
N$503: U58.18(2Q) U67.2(I2)
N$504: U58.17(3Q) U67.3(I3)
N$505: U58.16(4Q) U67.4(I4)
N$506: U58.15(5Q) U67.5(I5)
N$507: U58.14(6Q) U67.6(I6)
N$508: U58.13(7Q) U67.7(I7)
N$509: U58.12(8Q) U67.8(I8)
N$510: U59.19(1Q) U68.1(I1)
N$511: U59.18(2Q) U68.2(I2)
N$512: U59.17(3Q) U68.3(I3)
N$513: U59.16(4Q) U68.4(I4)
N$514: U59.15(5Q) U68.5(I5)
N$515: U59.14(6Q) U68.6(I6)
N$516: U59.13(7Q) U68.7(I7)
N$517: K7.17 U65.18(O1)
N$518: K7.18 U65.17(O2)
N$519: K7.19 U65.16(O3)
N$520: K7.20 U65.15(O4)
N$521: K7.21 U65.14(O5)
N$522: K7.22 U65.13(O6)
N$523: K7.23 U65.12(O7)
N$524: K7.24 U65.11(O8)
N$525: U57.12(8Q) U66.8(I8)
N$526: U57.13(7Q) U66.7(I7)
N$527: U57.14(6Q) U66.6(I6)
N$528: U57.15(5Q) U66.5(I5)
N$529: U57.16(4Q) U66.4(I4)
N$530: U57.17(3Q) U66.3(I3)
N$531: U57.18(2Q) U66.2(I2)
N$532: U57.19(1Q) U66.1(I1)
N$533: U55.19(1Q) U64.1(I1)
N$534: U55.18(2Q) U64.2(I2)
N$535: U55.17(3Q) U64.3(I3)
N$536: U55.16(4Q) U64.4(I4)
N$537: U55.15(5Q) U64.5(I5)
N$538: U55.14(6Q) U64.6(I6)
N$539: U55.13(7Q) U64.7(I7)
N$540: U55.12(8Q) U64.8(I8)
N$541: U56.19(1Q) U65.1(I1)
N$542: U56.18(2Q) U65.2(I2)
N$543: U56.17(3Q) U65.3(I3)
N$544: U56.16(4Q) U65.4(I4)
N$545: U56.15(5Q) U65.5(I5)
N$546: U56.14(6Q) U65.6(I6)
N$547: U56.13(7Q) U65.7(I7)
N$548: U56.12(8Q) U65.8(I8)
N$549: U54.12(8Q) U63.8(I8)
N$550: U54.13(7Q) U63.7(I7)
N$551: U54.14(6Q) U63.6(I6)
N$552: U54.15(5Q) U63.5(I5)
N$553: U54.16(4Q) U63.4(I4)
N$554: U54.17(3Q) U63.3(I3)
N$555: U54.18(2Q) U63.2(I2)
N$556: U54.19(1Q) U63.1(I1)
N$557: U59.12(8Q) U68.8(I8)
N$558: U60.11(CLK) U62.9(!Y6)
N$559: U59.11(CLK) U62.10(!Y5)
N$560: U58.11(CLK) U62.11(!Y4)
N$561: U57.11(CLK) U62.12(!Y3)
N$562: U56.11(CLK) U62.13(!Y2)
N$563: U55.11(CLK) U62.14(!Y1)
N$564: U54.11(CLK) U62.15(!Y0)
N$565: U61.11(CLK) U62.7(!Y7)
N$566: R6.2 U62.6(G1)
N$567: K8.1 U80.18(O1)
N$568: K8.2 U80.17(O2)
N$569: K8.3 U80.16(O3)
N$570: K8.4 U80.15(O4)
N$571: K8.5 U80.14(O5)
N$572: K8.6 U80.13(O6)
N$573: K8.7 U80.12(O7)
N$574: K8.8 U80.11(O8)
N$575: K8.9 U81.18(O1)
N$576: K8.10 U81.17(O2)
N$577: K8.11 U81.16(O3)
N$578: K8.12 U81.15(O4)
N$579: K8.13 U81.14(O5)
N$580: K8.14 U81.13(O6)
N$581: K8.15 U81.12(O7)
N$582: K8.16 U81.11(O8)
N$583: K8.25 U83.18(O1)
N$584: K8.26 U83.17(O2)
N$585: K8.27 U83.16(O3)
N$586: K8.28 U83.15(O4)
N$587: K8.29 U83.14(O5)
N$588: K8.30 U83.13(O6)
N$589: K8.31 U83.12(O7)
N$590: K8.32 U83.11(O8)
N$591: K8.33 U84.18(O1)
N$592: K8.34 U84.17(O2)
N$593: K8.35 U84.16(O3)
N$594: K8.36 U84.15(O4)
N$595: K8.37 U84.14(O5)
N$596: K8.38 U84.13(O6)
N$597: K8.39 U84.12(O7)
N$598: K8.40 U84.11(O8)
N$599: K8.41 U85.18(O1)
N$600: K8.42 U85.17(O2)
N$601: K8.43 U85.16(O3)
N$602: K8.44 U85.15(O4)
N$603: K8.45 U85.14(O5)
N$604: K8.46 U85.13(O6)
N$605: K8.47 U85.12(O7)
N$606: K8.48 U85.11(O8)
N$607: K8.49 U86.18(O1)
N$608: K8.50 U86.17(O2)
N$609: K8.51 U86.16(O3)
N$610: K8.52 U86.15(O4)
N$611: K8.53 U86.14(O5)
N$612: K8.54 U86.13(O6)
N$613: K8.55 U86.12(O7)
N$614: K8.56 U86.11(O8)
N$615: K8.57 U87.18(O1)
N$616: K8.58 U87.17(O2)
N$617: K8.59 U87.16(O3)
N$618: K8.60 U87.15(O4)
N$619: K8.61 U87.14(O5)
N$620: K8.62 U87.13(O6)
N$621: K8.63 U87.12(O7)
N$622: K8.64 U87.11(O8)
N$623: U78.12(8Q) U87.8(I8)
N$624: U78.13(7Q) U87.7(I7)
N$625: U78.14(6Q) U87.6(I6)
N$626: U78.15(5Q) U87.5(I5)
N$627: U78.16(4Q) U87.4(I4)
N$628: U78.17(3Q) U87.3(I3)
N$629: U78.18(2Q) U87.2(I2)
N$630: U78.19(1Q) U87.1(I1)
N$631: U77.12(8Q) U86.8(I8)
N$632: U77.13(7Q) U86.7(I7)
N$633: U77.14(6Q) U86.6(I6)
N$634: U77.15(5Q) U86.5(I5)
N$635: U77.16(4Q) U86.4(I4)
N$636: U77.17(3Q) U86.3(I3)
N$637: U77.18(2Q) U86.2(I2)
N$638: U77.19(1Q) U86.1(I1)
N$639: U75.19(1Q) U84.1(I1)
N$640: U75.18(2Q) U84.2(I2)
N$641: U75.17(3Q) U84.3(I3)
N$642: U75.16(4Q) U84.4(I4)
N$643: U75.15(5Q) U84.5(I5)
N$644: U75.14(6Q) U84.6(I6)
N$645: U75.13(7Q) U84.7(I7)
N$646: U75.12(8Q) U84.8(I8)
N$647: U76.12(8Q) U85.8(I8)
N$648: U76.13(7Q) U85.7(I7)
N$649: U76.14(6Q) U85.6(I6)
N$650: U76.15(5Q) U85.5(I5)
N$651: U76.16(4Q) U85.4(I4)
N$652: U76.17(3Q) U85.3(I3)
N$653: U76.18(2Q) U85.2(I2)
N$654: K8.17 U82.18(O1)
N$655: K8.18 U82.17(O2)
N$656: K8.19 U82.16(O3)
N$657: K8.20 U82.15(O4)
N$658: K8.21 U82.14(O5)
N$659: K8.22 U82.13(O6)
N$660: K8.23 U82.12(O7)
N$661: K8.24 U82.11(O8)
N$662: U74.12(8Q) U83.8(I8)
N$663: U74.13(7Q) U83.7(I7)
N$664: U74.14(6Q) U83.6(I6)
N$665: U74.15(5Q) U83.5(I5)
N$666: U74.16(4Q) U83.4(I4)
N$667: U74.17(3Q) U83.3(I3)
N$668: U74.18(2Q) U83.2(I2)
N$669: U74.19(1Q) U83.1(I1)
N$670: U72.19(1Q) U81.1(I1)
N$671: U72.18(2Q) U81.2(I2)
N$672: U72.17(3Q) U81.3(I3)
N$673: U72.16(4Q) U81.4(I4)
N$674: U72.15(5Q) U81.5(I5)
N$675: U72.14(6Q) U81.6(I6)
N$676: U72.13(7Q) U81.7(I7)
N$677: U72.12(8Q) U81.8(I8)
N$678: U73.19(1Q) U82.1(I1)
N$679: U73.18(2Q) U82.2(I2)
N$680: U73.17(3Q) U82.3(I3)
N$681: U73.16(4Q) U82.4(I4)
N$682: U73.15(5Q) U82.5(I5)
N$683: U73.14(6Q) U82.6(I6)
N$684: U73.13(7Q) U82.7(I7)
N$685: U73.12(8Q) U82.8(I8)
N$686: U71.12(8Q) U80.8(I8)
N$687: U71.13(7Q) U80.7(I7)
N$688: U71.14(6Q) U80.6(I6)
N$689: U71.15(5Q) U80.5(I5)
N$690: U71.16(4Q) U80.4(I4)
N$691: U71.17(3Q) U80.3(I3)
N$692: U71.18(2Q) U80.2(I2)
N$693: U71.19(1Q) U80.1(I1)
N$694: U76.19(1Q) U85.1(I1)
N$695: U77.11(CLK) U79.9(!Y6)
N$696: U76.11(CLK) U79.10(!Y5)
N$697: U75.11(CLK) U79.11(!Y4)
N$698: U74.11(CLK) U79.12(!Y3)
N$699: U73.11(CLK) U79.13(!Y2)
N$700: U72.11(CLK) U79.14(!Y1)
N$701: U71.11(CLK) U79.15(!Y0)
N$702: U78.11(CLK) U79.7(!Y7)
N$703: R7.2 U79.6(G1)
VCC: C37.2 C38.2 C39.2 C40.2 C41.2 C42.2 C43.2 C44.2 C45.2 C54.2 C55.2 C56.2 C57.2 C58.2 C59.2 C60.2 C61.2 C62.2 C71.2 C72.2 C73.2 C74.2 C75.2 C76.2 C77.2 C78.2 C79.2 C204.2 C205.2 C206.2 C207.2 R5.1 R6.1 R7.1 U46.9(VPP) U47.9(VPP) U48.9(VPP) U49.9(VPP) U50.9(VPP) U51.9(VPP) U52.9(VPP) U53.9(VPP) U63.9(VPP) U64.9(VPP) U65.9(VPP) U66.9(VPP) U67.9(VPP) U68.9(VPP) U69.9(VPP) U70.9(VPP) U80.9(VPP) U81.9(VPP) U82.9(VPP) U83.9(VPP) U84.9(VPP) U85.9(VPP) U86.9(VPP) U87.9(VPP) ; also sheet 1,3,4

### Buses
D[0..7]
A[0..5],E[0..15],IL,OL

### Notes on the sheet
- REJSTRIKY - VYSTUPY